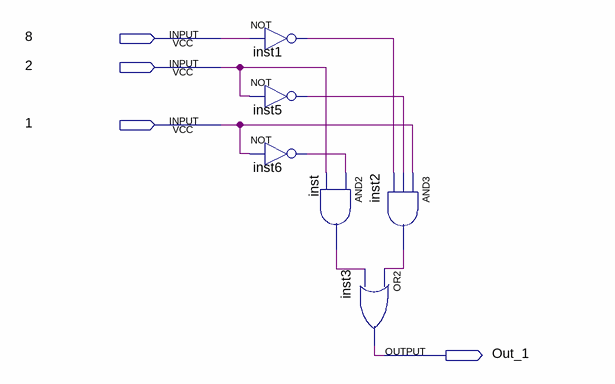
[diagram p0: schematic sheet]
// Quartus schematic D1.bdf as structural Verilog: 6 symbols, 4 pins
module D1 (
  input  \8 ,
  input  \2 ,
  input  \1 ,
  output Out_1
);

  wire inst1_out, inst2_out, inst5_out, inst6_out, inst_out;

  not inst1 (inst1_out, \8 );
  not inst5 (inst5_out, \2 );
  not inst6 (inst6_out, \1 );
  and inst (inst_out, inst6_out, \2 );
  and inst2 (inst2_out, \1 , inst5_out, inst1_out);
  or inst3 (Out_1, inst2_out, inst_out);
endmodule
